# Altium schematic sheet TopLevel.SchDoc: Main Board - Top Level
size A; Author: Tim Jager; DrawnBy: Tim Jager; Engineer: Tim Jager; DocumentNumber: 1; Revision: 0; SheetNumber: 1; SheetTotal: 3; PageSetup: Record=PageOptions|CenterHorizontal=True|CenterVertical=True|PrintScale=1.51|XCorrection=1.00|YCorrection=1.00|PrintKind=0|BorderSize=5000000|LeftOffset=0|BottomOffset=0|Orientation=2|PaperLength=1000|PaperWidth=1000|Scale=100|PaperSource=7|PrintQuality=-4|MediaType=1|DitherType=10|PaperKind=A1 (594 x 841 mm)|PrintScaleMode=1
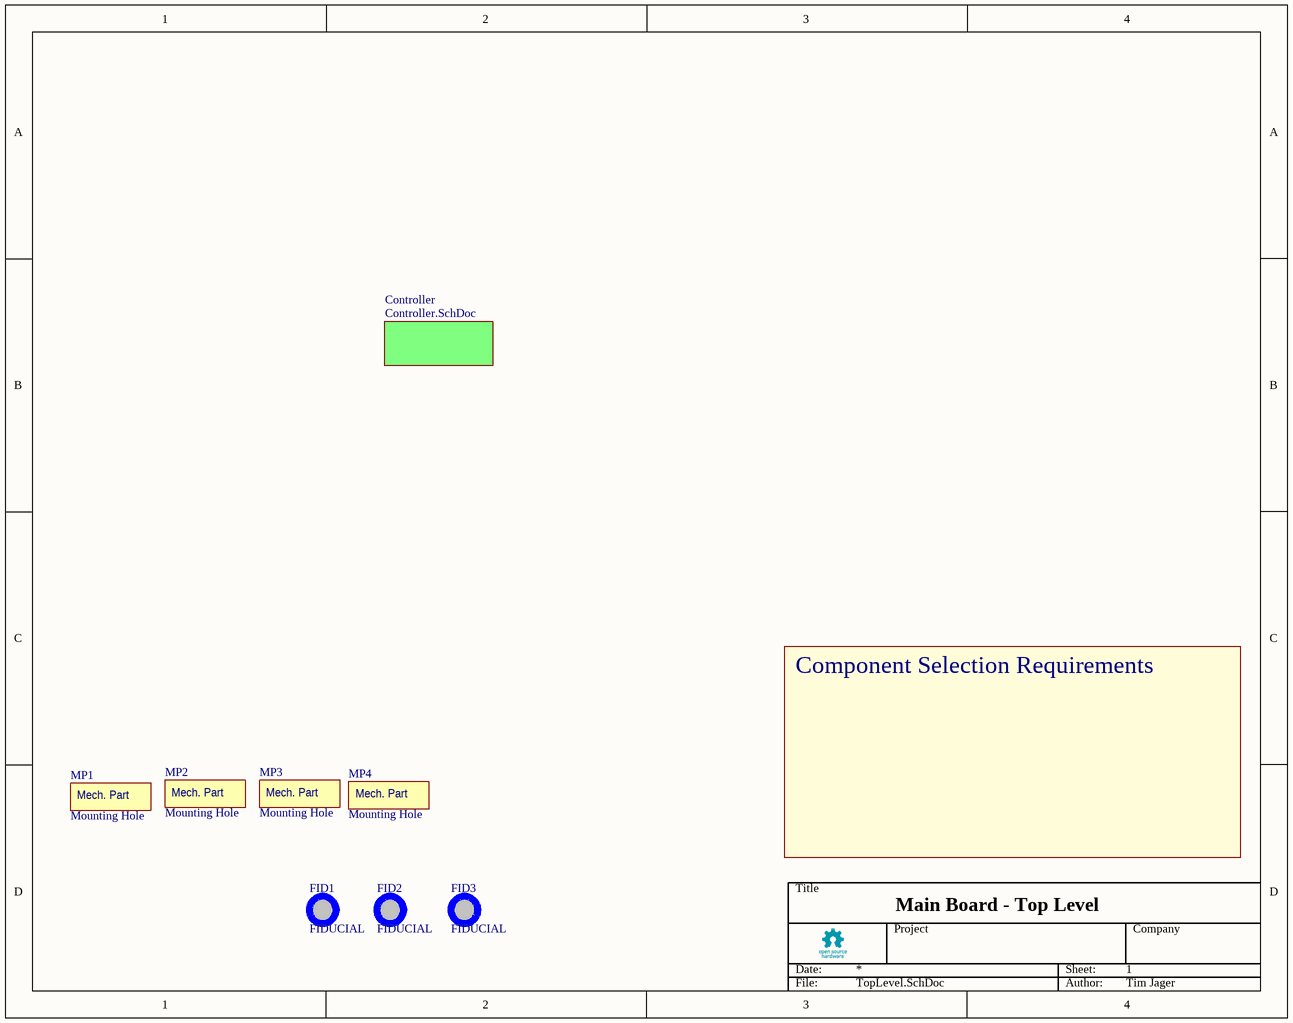
[diagram p0: TopLevel.SchDoc]

## Parts
FID1  FIDUCIAL  [FIDUCIAL]  (no BOM)
FID2  FIDUCIAL  [FIDUCIAL]  (no BOM)
FID3  FIDUCIAL  [FIDUCIAL]  (no BOM)
MP1  Mounting Hole  [M2_Standoff_Mounting_Hole]  (no BOM)
MP2  Mounting Hole  [M2_Standoff_Mounting_Hole]  (no BOM)
MP3  Mounting Hole  [M2_Standoff_Mounting_Hole]  (no BOM)
MP4  Mounting Hole  [M2_Standoff_Mounting_Hole]  (no BOM)

## Sub-sheets
Controller = Controller.SchDoc: no entries

## Notes on the sheet
- Component Selection Requirements
- Title
- Date:
- Project
- Sheet:
- Company
- File:
- Author:
- (in symbol MechPart_1) Mech. Part

## Library data of the parts
FID1-FID3 = FIDUCIAL: Board or Local Fiducial mark; Manufacturer Part Number: #N/A; Supplier Part Number 1: NA; Supplier 1: NA
MP1-MP4 = MechPart_1